# Altium project Gimbal19.PrjPcb
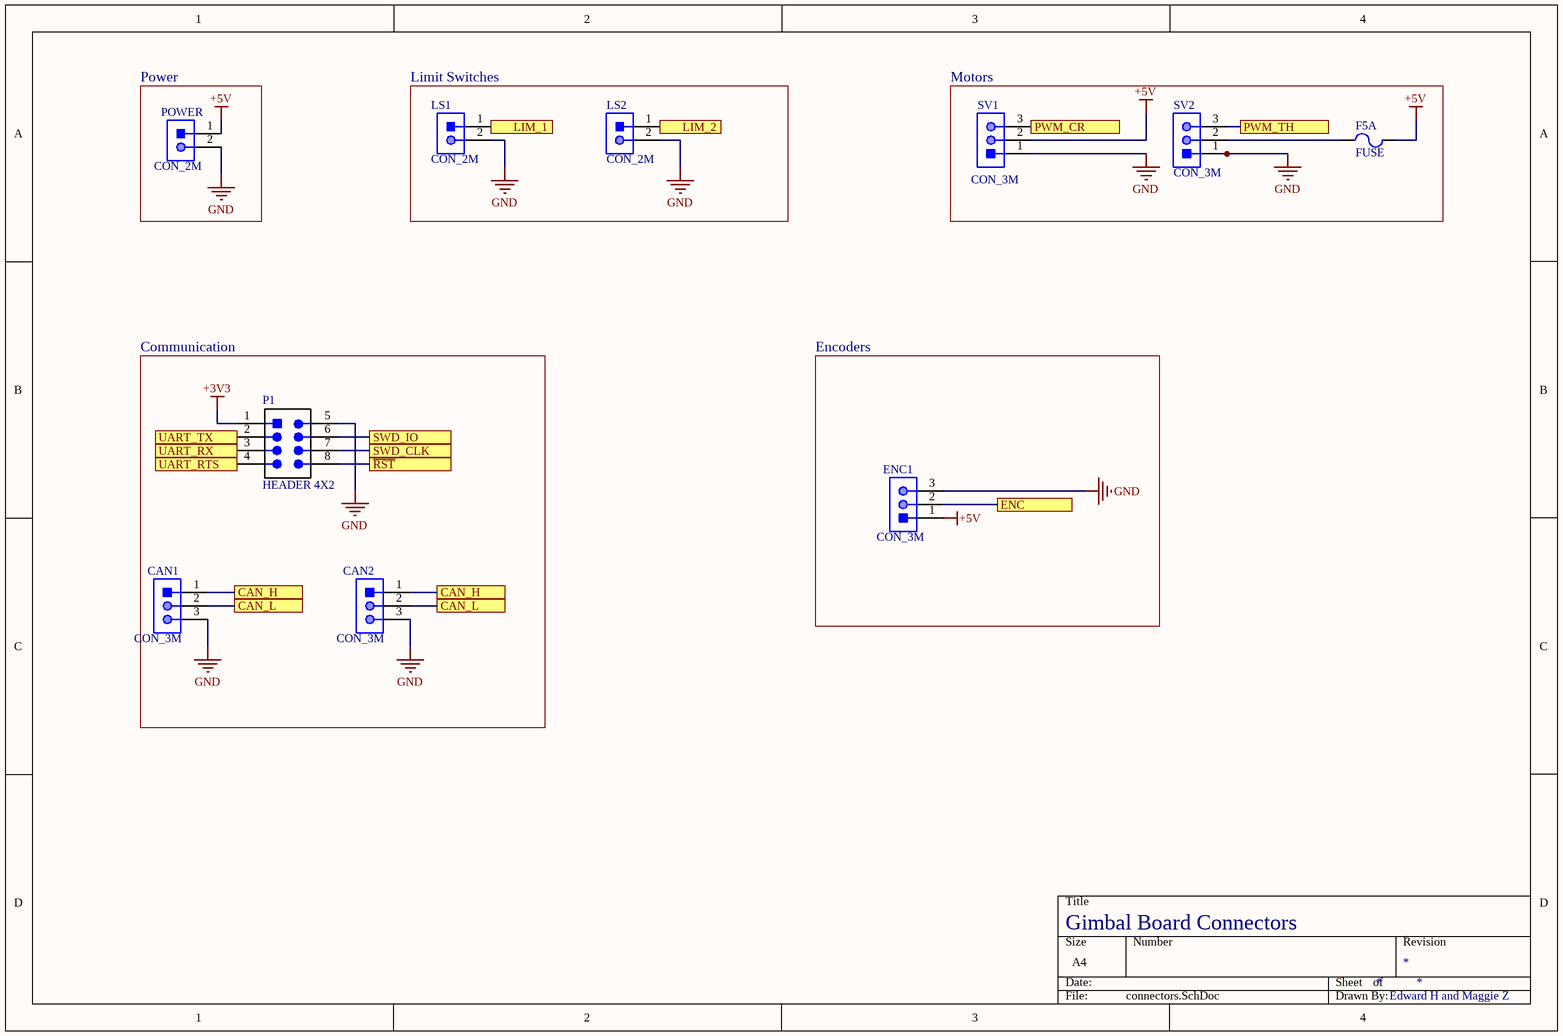
[diagram p0: connectors.SchDoc]
4 sheets, 59 parts. Net scope: flat (ports and power ports of the same name join across sheets).
Board file: Gimbal19_V1.PcbDoc
Sheets:
  connectors.SchDoc
  mcu.SchDoc
  power.SchDoc
  support.SchDoc

## Sheet connectors.SchDoc: Gimbal Board Connectors
size A4; DrawnBy: Edward H and Maggie Z

### Parts
(Parts that share a designator on the sheet are numbered #1, #2 ... from top to bottom, then left to right.)
CAN1  CON_3M  [JST-B3B-SM4-TB]
CAN2  CON_3M  [JST-B3B-SM4-TB]
ENC1  CON_3M  [JST-B3B-SM4-TB]
F5A  FUSE  [FUSE]
LS1  CON_2M  [JST-B2B-SM4-TB]
LS2  CON_2M  [JST-B2B-SM4-TB]
P1  HEADER 4X2  [HEADER_2X4]
POWER  CON_2M  [JST-B2B-PHSK]
SV1#1  CON_3M  [JST-B3B-SM4-TB]
SV2#1  CON_3M  [JST B03B-PASK]

### Blocks framed on the sheet
Power: POWER
Limit Switches: LS1 LS2
Motors: F5A SV1#1 SV2#1
Communication: CAN1 CAN2 P1
Encoders: ENC1

### Ports
CAN_H, CAN_L, ENC, LIM_1, LIM_2, PWM_CR, PWM_TH, SWD_CLK, SWD_IO, UART_RTS, UART_RX, UART_TX, ~{RST}

### Nets
+3V3: P1.1(VCC)
+5V: ENC1.1 F5A.2 POWER.1 SV1#1.2
GND: CAN1.3 CAN2.3 ENC1.3 LS1.2 LS2.2 P1.5(GND) POWER.2 SV1#1.1 SV2#1.1
~{RST}: P1.8 ; port ~{RST}
NetCAN1_1: CAN1.1 CAN2.1 ; port CAN_H
NetCAN1_2: CAN1.2 CAN2.2 ; port CAN_L
NetENC_1: ENC1.2 ; port ENC
NetF5A_1: F5A.1 SV2#1.2
NetLS1_1: LS1.1 ; port LIM_1
NetLS2_1: LS2.1 ; port LIM_2
NetP1_2: P1.2 ; port UART_TX
NetP1_3: P1.3 ; port UART_RX
NetP1_4: P1.4 ; port UART_RTS
NetP1_6: P1.6 ; port SWD_IO
NetP1_7: P1.7 ; port SWD_CLK
NetR4_2: SV1#1.3 ; port PWM_CR
NetR5_2: SV2#1.3 ; port PWM_TH

### Library data of the parts
F5A = FUSE-5A: FUSE HOLDER RADIAL 250V 6.3A PCB
P1 = HEADER 4X2: Header, 4-Pin Dual row; MPN: GRPB042VWVN-RC; Manufacturer: Sullins Connector Solutions; Digikey Part Number: S9015E-04-ND

## Sheet mcu.SchDoc: Gimbal Board MCU
size A4; DrawnBy: Edward H and Maggie Z
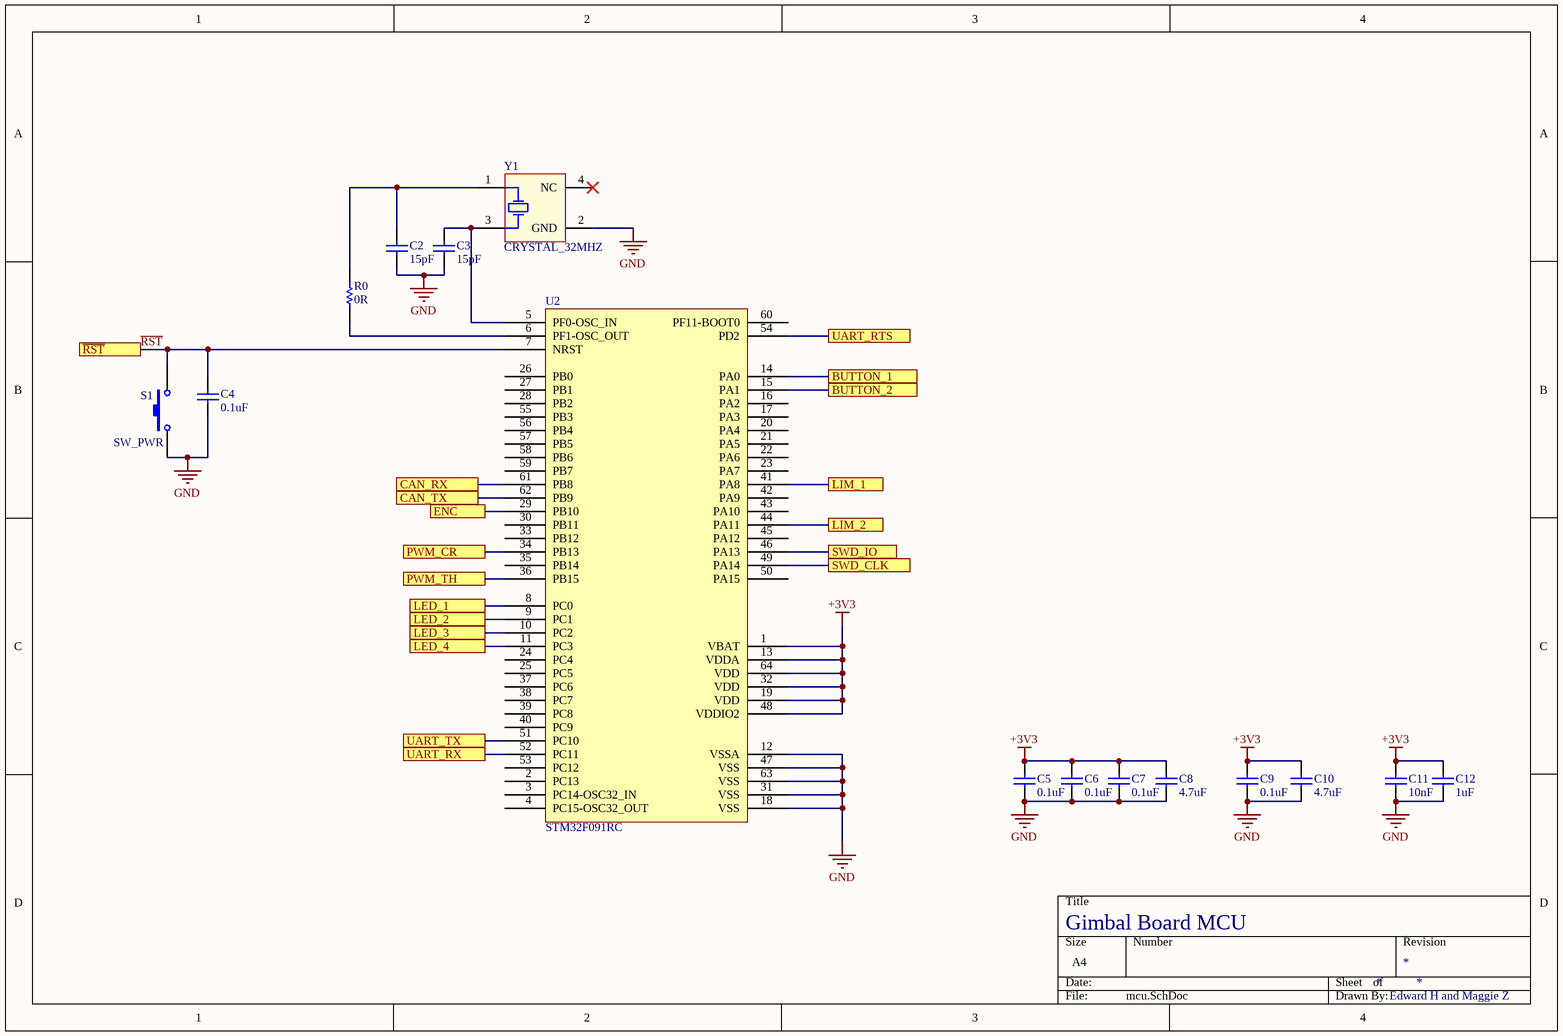
[diagram p1: mcu.SchDoc]

### Parts
C2  value 15pF  [CAPC0603(1608)55_N]  (hidden comment: CAP_15pF_0603)
C3  value 15pF  [CAPC0603(1608)55_N]  (hidden comment: CAP_15pF_0603)
C4  value 0.1uF  [CAPC0603(1608)55_N]  (hidden comment: CAP_0.1uF_16V_0603)
C5  value 0.1uF  [CAPC0603(1608)55_N]  (hidden comment: CAP_0.1uF_16V_0603)
C6  value 0.1uF  [CAPC0603(1608)55_N]  (hidden comment: CAP_0.1uF_16V_0603)
C7  value 0.1uF  [CAPC0603(1608)55_N]  (hidden comment: CAP_0.1uF_16V_0603)
C8  value 4.7uF  [CAPC0603(1608)55_N]  (hidden comment: CAP_4.7uF_0603)
C9  value 0.1uF  [CAPC0603(1608)55_N]  (hidden comment: CAP_0.1uF_16V_0603)
C10  value 4.7uF  [CAPC0603(1608)55_N]  (hidden comment: CAP_4.7uF_0603)
C11  value 10nF  [CAPC0603(1608)55_N]  (hidden comment: CAP_10nF_0603)
C12  value 1uF  [CAPC0603(1608)55_N]  (hidden comment: CAP_1uF_16V_0603)
R0  value 0R  [RESC0603(1608)_N]  (hidden comment: RES_0R_0603)
S1  SW_PWR  [PTS830GM140]
U2  STM32F091RC  [STM_LQFP64_N]
Y1  CRYSTAL_32MHZ  [AVX-CX2520DB32000D0GEJZ1-4_V]

### Ports
BUTTON_1, BUTTON_2, CAN_RX, CAN_TX, ENC, LED_1, LED_2, LED_3, LED_4, LIM_1, LIM_2, PWM_CR, PWM_TH, SWD_CLK, SWD_IO, UART_RTS, UART_RX, UART_TX, ~{RST}

### Nets
+3V3: C5.1 C6.1 C7.1 C8.2 C9.1 C10.2 C11.2 C12.2 U2.1(VBAT) U2.13(VDDA) U2.19(VDD) U2.32(VDD) U2.48(VDDIO2) U2.64(VDD)
GND: C2.1 C3.1 C4.1 C5.2 C6.2 C7.2 C8.1 C9.2 C10.1 C11.1 C12.1 S1.1 U2.12(VSSA) U2.18(VSS) U2.31(VSS) U2.47(VSS) U2.63(VSS) Y1.2(GND)
~{RST}: C4.2 S1.2 U2.7(NRST) ; port ~{RST}
NetC2_2: C2.2 R0.2 Y1.1(HOT)
NetC3_2: C3.2 U2.5(PF0-OSC_IN) Y1.3(HOT)
NetENC_1: U2.29(PB10) ; port ENC
NetLS1_1: U2.41(PA8) ; port LIM_1
NetLS2_1: U2.44(PA11) ; port LIM_2
NetP1_2: U2.51(PC10) ; port UART_TX
NetP1_3: U2.52(PC11) ; port UART_RX
NetP1_4: U2.54(PD2) ; port UART_RTS
NetP1_6: U2.46(PA13) ; port SWD_IO
NetP1_7: U2.49(PA14) ; port SWD_CLK
NetR0_1: R0.1 U2.6(PF1-OSC_OUT)
NetR4_2: U2.34(PB13) ; port PWM_CR
NetR5_2: U2.36(PB15) ; port PWM_TH
NetR6_1: U2.14(PA0) ; port BUTTON_1
NetR7_2: U2.15(PA1) ; port BUTTON_2
NetR10_2: U2.8(PC0) ; port LED_1
NetR11_2: U2.9(PC1) ; port LED_2
NetR12_2: U2.10(PC2) ; port LED_3
NetR13_2: U2.11(PC3) ; port LED_4
NetU2_61: U2.61(PB8) ; port CAN_RX
NetU2_62: U2.62(PB9) ; port CAN_TX

Not connected (* = marked no-connect by the designer): U2 2(PC13) 3(PC14-OSC32_IN) 4(PC15-OSC32_OUT) 16(PA2) 17(PA3) 20(PA4) 21(PA5) 22(PA6) 23(PA7) 24(PC4) 25(PC5) 26(PB0) 27(PB1) 28(PB2) 30(PB11) 33(PB12) 35(PB14) 37(PC6) 38(PC7) 39(PC8) 40(PC9) 42(PA9) 43(PA10) 45(PA12) 50(PA15) 53(PC12) 55(PB3) 56(PB4) 57(PB5) 58(PB6) 59(PB7) 60(PF11-BOOT0); Y1 4(NC)*

### Library data of the parts
C2 C3 = CAP_15pF_0603: CAP CER 15PF 250V NPO 0603; Manufacturer: Yageo; MPN: AC0603JRNPOYBN150; Temperature Coefficient: NP0; Dimensions: 0.063" L x 0.031" W (1.60mm x 0.80mm); Package: 0603 (1608 Metric); Voltage Rating: 250v; Digikey Part Number: 311-3282-1-ND
C4-C7 C9 = CAP_0.1uF_16V_0603: CAP CER 0.1UF 16V X7R 0603; Manufacturer: Yageo; MPN: CC0603KRX7R7BB104; Dimensions: 0.063" L x 0.031" W (1.60mm x 0.80mm); Package: 0603 (1608 Metric); Temperature Coefficient: X7R; Voltage Rating: 16V; Digikey Part Number: 311-1088-1-ND
C8 C10 = CAP_4.7uF_0603: CAP CER 4.7UF 6.3V X5R 0603; Manufacturer: Yageo; MPN: CC0603KRX5R5BB475; Dimensions: 0.063" L x 0.031" W (1.60mm x 0.80mm); Package: 0603 (1608 Metric); Temperature Coefficient: X5R; Voltage Rating: 6.3V; Digikey Part Number: 311-1521-1-ND
C11 = CAP_10nF_0603: CAP CER 10000PF 16V X7R 0603; Manufacturer: Yageo; MPN: CC0603KRX7R7BB103; Dimensions: 0.063" L x 0.031" W (1.60mm x 0.80mm); Package: 0603 (1608 Metric); Temperature Coefficient: X7R; Voltage Rating: 16V; Digikey Part Number: 311-3369-1-ND
C12 = CAP_1uF_16V_0603: CAP CER 1UF 16V Y5V 0603; Manufacturer: Yageo; MPN: CC0603ZRY5V7BB105; Dimensions: 0.063" L x 0.031" W (1.60mm x 0.80mm); Package: 0603 (1608 Metric); Temperature Coefficient: Y5V; Voltage Rating: 16V; Digikey Part Number: 311-1372-1-ND
R0 = RES_0R_0603: RES SMD 0 OHM JUMPER 1/10W 0603; Manufacturer: Yageo; MPN: RC0603JR-070RL; Package: 0603 (1608 Metric); Dimensions: 0.063" L x 0.031" W (1.60mm x 0.80mm); Digikey Part Number: 311-0.0GRCT-ND
S1 = SW_PWR: Power Switch (Red); pin to pad: 2>4; MPN: PTS830GM140 SMTR LFS; Manufacturer: C&K; ComponentLink1Description: Datasheet; ComponentLink1URL: https://www.ckswitches.com/media/1478/pts830.pdf; Digikey Part Number: CKN10587CT-ND
U2 = STM32F091RC: Manufacturer: STMicroelectronics; Package: 64-LQFP; ComponentLink1Description: Datasheet; ComponentLink1URL: https://www.st.com/content/ccc/resource/technical/document/datasheet/95/3c/2e/5b/21/09/45/a6/DM00115237.pdf/files/DM00115237.pdf/jcr:content/translations/en.DM00115237.pdf#%5B%7B%22num%22%3A96%2C%22gen%22%3A0%7D%2C%7B%22name%22%3A%22XYZ%22%7D%2C67%2C755%2Cnull%5D; MPN: STM32F091RC; Digikey Part Number: 497-15167-ND
Y1 = CRYSTAL_32MHZ: CRYSTAL 32MHZ 8PF SMD; Manufacturer: Kyocera International Inc. Electronic Components; MPN: CX2520DB32000D0GPSC1; Package: 4-SMD, No Lead; Dimensions: 0.098" L x 0.079" W (2.50mm x 2.00mm); Digikey Part Number: 1253-1730-1-ND

## Sheet power.SchDoc: Power
size A4; DrawnBy: Edward H and Maggie Z
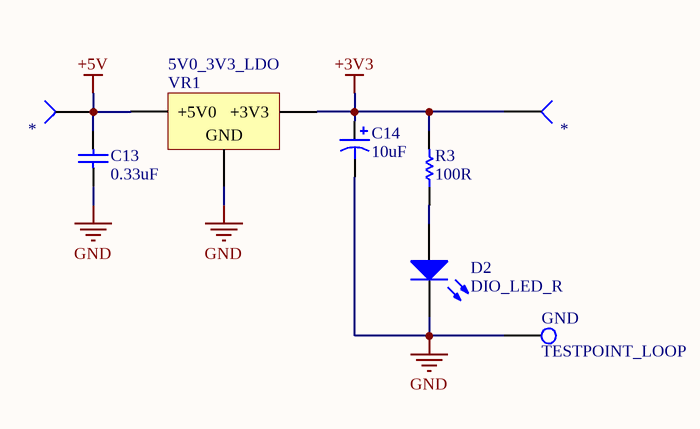
[diagram p2: power.SchDoc]

### Parts
3V3  *  [TESTPOINT]
C13  value 0.33uF  [CAPC0603(1608)55_N]  (hidden comment: CAP_0.33uF_16V_0603)
C14  value 10uF  [AVX-CAPC3528_V]  (hidden comment: CAP_10uF_1411_POL)
D2  DIO_LED_R  [LED_0805_LINE]
GND  TESTPOINT_LOOP  [TESTPOINT_LOOP]
R3  value 100R  [RESC0603(1608)_N]  (hidden comment: RES_100R_0603)
TESTPOINT_5V  *  [TESTPOINT]
VR1  5V0_3V3_LDO  [VOLTAGE_REGULATOR]

### Nets
+3V3: 3V3.1(=value) C14.1 R3.2 VR1.2(+3V3)
+5V: C13.2 TESTPOINT_5V.1(=value) VR1.3(+5V0)
GND: C13.1 C14.2 D2.2(K) GND.1(=value) VR1.1(GND)
NetD2_1: D2.1(A) R3.1

### Library data of the parts
3V3 TESTPOINT_5V = *: TESTPOINT_SMD; Part Number (MPN): *
C13 = CAP_0.33uF_16V_0603: CAP CER 0.33UF 16V X7R 0603; Manufacturer: Murata Electronics North America; MPN: GCM188R71C334KA37D; Dimensions: 0.063" L x 0.031" W (1.60mm x 0.80mm); Package: 0603 (1608 Metric); Temperature Coefficient: X7R; Voltage Rating: 16V; Digikey Part Number: 490-6050-1-ND
C14 = CAP_10uF_1411_POL: CAP TANT 10UF 20% 10V 1411; MPN: F971A106MBAHT3; Manufacturer: AVX Corporation; Dimensions: 0.063" L x 0.031" W (1.60mm x 0.80mm); Package: 1411 (3528 Metric); Voltage Rating: 10V; Digikey Part Number: 478-12047-1-ND
D2 = DIO_LED_R: LED RED DIFFUSED 0805 SMD; Manufacturer: OSRAM; MPN: LS R976-NR-1; Forward Voltage Drop: 2V; Package: 0805 (2012 Metric); Digikey Part Number: 475-1278-1-ND
R3 = RES_100R_0603: RES SMD 100 OHM 1% 1/10W 0603; Manufacturer: Yageo; MPN: RC0603FR-07100RL; Package: 0603 (1608 Metric); Dimensions: 0.063" L x 0.031" W (1.60mm x 0.80mm); Tolerance: 1%; Digikey Part Number: 311-100HRCT-ND
VR1 = 5V0_3V3_LDO: IC REG LINEAR 3.3V 1A DPAK; Manufacturer: ON Semiconductor; MPN: NCP1117DT33T5G; Current Output: 1A; Digikey Part Number: NCP1117DT33T5GOSCT-ND

## Sheet support.SchDoc: Support
size A4; DrawnBy: Edward H and Maggie Z
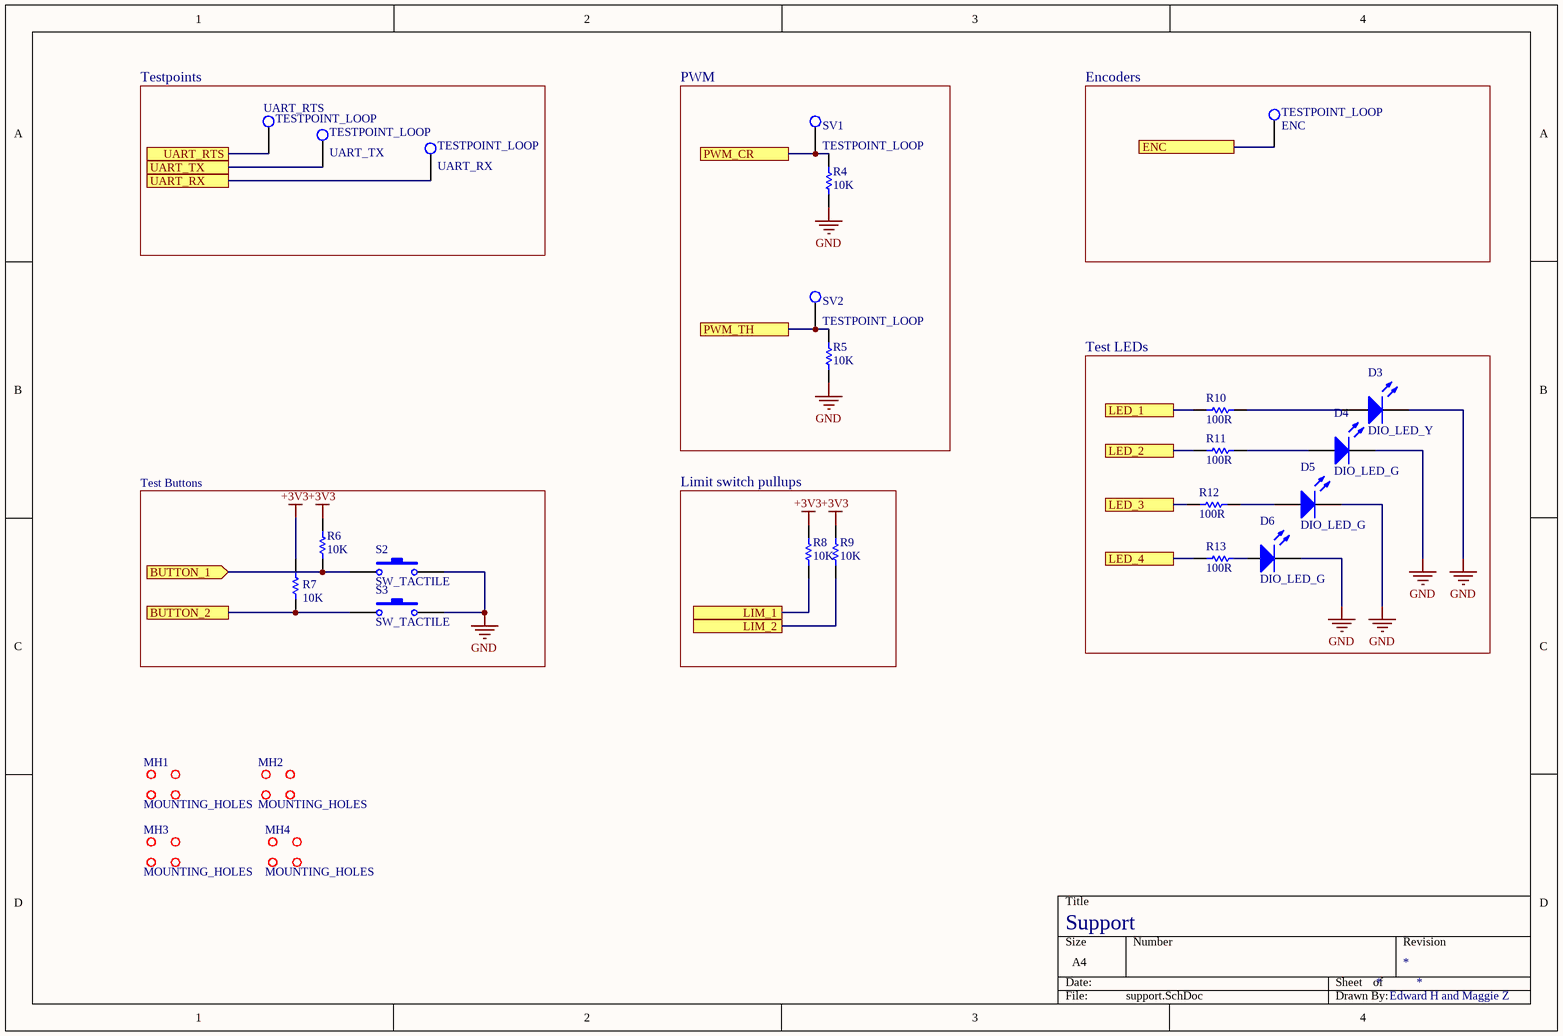
[diagram p3: support.SchDoc]

### Parts
(Parts that share a designator on the sheet are numbered #1, #2 ... from top to bottom, then left to right.)
D3  DIO_LED_Y  [LED_0805_LINE]
D4  DIO_LED_G  [LED_0805_LINE]
D5  DIO_LED_G  [LED_0805_LINE]
D6  DIO_LED_G  [LED_0805_LINE]
ENC  TESTPOINT_LOOP  [TESTPOINT_LOOP]
MH1  MOUNTING_HOLES  [MOUNTING_HOLE]
MH2  MOUNTING_HOLES  [MOUNTING_HOLE]
MH3  MOUNTING_HOLES  [MOUNTING_HOLE]
MH4  MOUNTING_HOLES  [MOUNTING_HOLE]
R4  value 10K  [RESC0603(1608)_N]  (hidden comment: RES_10K_0603)
R5  value 10K  [RESC0603(1608)_N]  (hidden comment: RES_10K_0603)
R6  value 10K  [RESC0603(1608)_N]  (hidden comment: RES_10K_0603)
R7  value 10K  [RESC0603(1608)_N]  (hidden comment: RES_10K_0603)
R8  value 10K  [RESC0603(1608)_N]  (hidden comment: RES_10K_0603)
R9  value 10K  [RESC0603(1608)_N]  (hidden comment: RES_10K_0603)
R10  value 100R  [RESC0603(1608)_N]  (hidden comment: RES_100R_0603)
R11  value 100R  [RESC0603(1608)_N]  (hidden comment: RES_100R_0603)
R12  value 100R  [RESC0603(1608)_N]  (hidden comment: RES_100R_0603)
R13  value 100R  [RESC0603(1608)_N]  (hidden comment: RES_100R_0603)
S2  SW_TACTILE  [B3U-1100P]
S3  SW_TACTILE  [B3U-1100P]
SV1#2  TESTPOINT_LOOP  [TESTPOINT_LOOP]
SV2#2  TESTPOINT_LOOP  [TESTPOINT_LOOP]
UART_RTS  TESTPOINT_LOOP  [TESTPOINT_LOOP]
UART_RX  TESTPOINT_LOOP  [TESTPOINT_LOOP]
UART_TX  TESTPOINT_LOOP  [TESTPOINT_LOOP]

### Blocks framed on the sheet
Testpoints: UART_RTS UART_RX UART_TX
PWM: R4 R5 SV1#2 SV2#2
Encoders: ENC
Test LEDs: D3-D6 R10-R13
Test Buttons: R6 R7 S2 S3
Limit switch pullups: R8 R9

### Ports
BUTTON_1 (in), BUTTON_2, ENC, LED_1, LED_2, LED_3, LED_4, LIM_1, LIM_2, PWM_CR, PWM_TH, UART_RTS, UART_RX, UART_TX

### Nets
+3V3: R6.2 R7.1 R8.2 R9.2
GND: D3.2(K) D4.2(K) D5.2(K) D6.2(K) R4.1 R5.1 S2.2 S3.2
NetD3_1: D3.1(A) R10.1
NetD4_1: D4.1(A) R11.1
NetD5_1: D5.1(A) R12.1
NetD6_1: D6.1(A) R13.1
NetENC_1: ENC.1(=value) ; port ENC
NetLS1_1: R8.1 ; port LIM_1
NetLS2_1: R9.1 ; port LIM_2
NetP1_2: UART_TX.1(=value) ; port UART_TX
NetP1_3: UART_RX.1(=value) ; port UART_RX
NetP1_4: UART_RTS.1(=value) ; port UART_RTS
NetR4_2: R4.2 SV1#2.1(=value) ; port PWM_CR
NetR5_2: R5.2 SV2#2.1(=value) ; port PWM_TH
NetR6_1: R6.1 S2.1 ; port BUTTON_1
NetR7_2: R7.2 S3.1 ; port BUTTON_2
NetR10_2: R10.2 ; port LED_1
NetR11_2: R11.2 ; port LED_2
NetR12_2: R12.2 ; port LED_3
NetR13_2: R13.2 ; port LED_4

### Library data of the parts
D3 = DIO_LED_Y: LED YELLOW DIFFUSED 0805 SMD; Manufacturer: OSRAM; MPN: LY R976-PS-36; Forward Voltage Drop: 2.2V; Package: 0805 (2012 Metric); Digikey Part Number: 475-2560-1-ND
D4-D6 = DIO_LED_G: LED GREEN DIFFUSED 0805 SMD; Manufacturer: OSRAM; MPN: LG R971-KN-1; Forward Voltage Drop: 2.2V; Package: 0805 (2012 Metric); Digikey Part Number: 475-1410-1-ND
MH1-MH4 = MOUNTING_HOLES: 6cm x 6cm
R4-R9 = RES_10K_0603: RES SMD 10K OHM 5% 1/10W 0603; Manufacturer: Yageo; MPN: RC0603JR-0710KL; Package: 0603 (1608 Metric); Dimensions: 0.063" L x 0.031" W (1.60mm x 0.80mm); Tolerance: 5%; Digikey Part Number: 311-10KGRCT-ND
R10-R13 = RES_100R_0603: as R3 on sheet power; Package: 0603 (1608 Metric); Dimensions: 0.063" L x 0.031" W (1.60mm x 0.80mm); Tolerance: 1%; Digikey Part Number: 311-100HRCT-ND
S2 S3 = SW_TACTILE: Tactile Switch (Grey); Manufacturer: Omron Electronics Inc-EMC Div; Digikey Part Number: SW1021TR-ND; MPN: B3U-1100P

## Nets that join several sheets
+3V3: connectors (P1.1), mcu (14 pins), power (3V3.1 C14.1 R3.2 VR1.2), support (R6.2 R7.1 R8.2 R9.2)
+5V: connectors (ENC1.1 F5A.2 POWER.1 SV1#1.2), power (C13.2 TESTPOINT_5V.1 VR1.3)
GND: connectors (9 pins), mcu (18 pins), power (5 pins), support (8 pins)
NetENC_1: connectors (ENC1.2), mcu (U2.29), support (ENC.1)
NetLS1_1: connectors (LS1.1), mcu (U2.41), support (R8.1)
NetLS2_1: connectors (LS2.1), mcu (U2.44), support (R9.1)
NetP1_2: connectors (P1.2), mcu (U2.51), support (UART_TX.1)
NetP1_3: connectors (P1.3), mcu (U2.52), support (UART_RX.1)
NetP1_4: connectors (P1.4), mcu (U2.54), support (UART_RTS.1)
NetP1_6: connectors (P1.6), mcu (U2.46)
NetP1_7: connectors (P1.7), mcu (U2.49)
NetR4_2: connectors (SV1#1.3), mcu (U2.34), support (R4.2 SV1#2.1)
NetR5_2: connectors (SV2#1.3), mcu (U2.36), support (R5.2 SV2#2.1)
NetR6_1: mcu (U2.14), support (R6.1 S2.1)
NetR7_2: mcu (U2.15), support (R7.2 S3.1)
NetR10_2: mcu (U2.8), support (R10.2)
NetR11_2: mcu (U2.9), support (R11.2)
NetR12_2: mcu (U2.10), support (R12.2)
NetR13_2: mcu (U2.11), support (R13.2)
~{RST}: connectors (P1.8), mcu (C4.2 S1.2 U2.7)